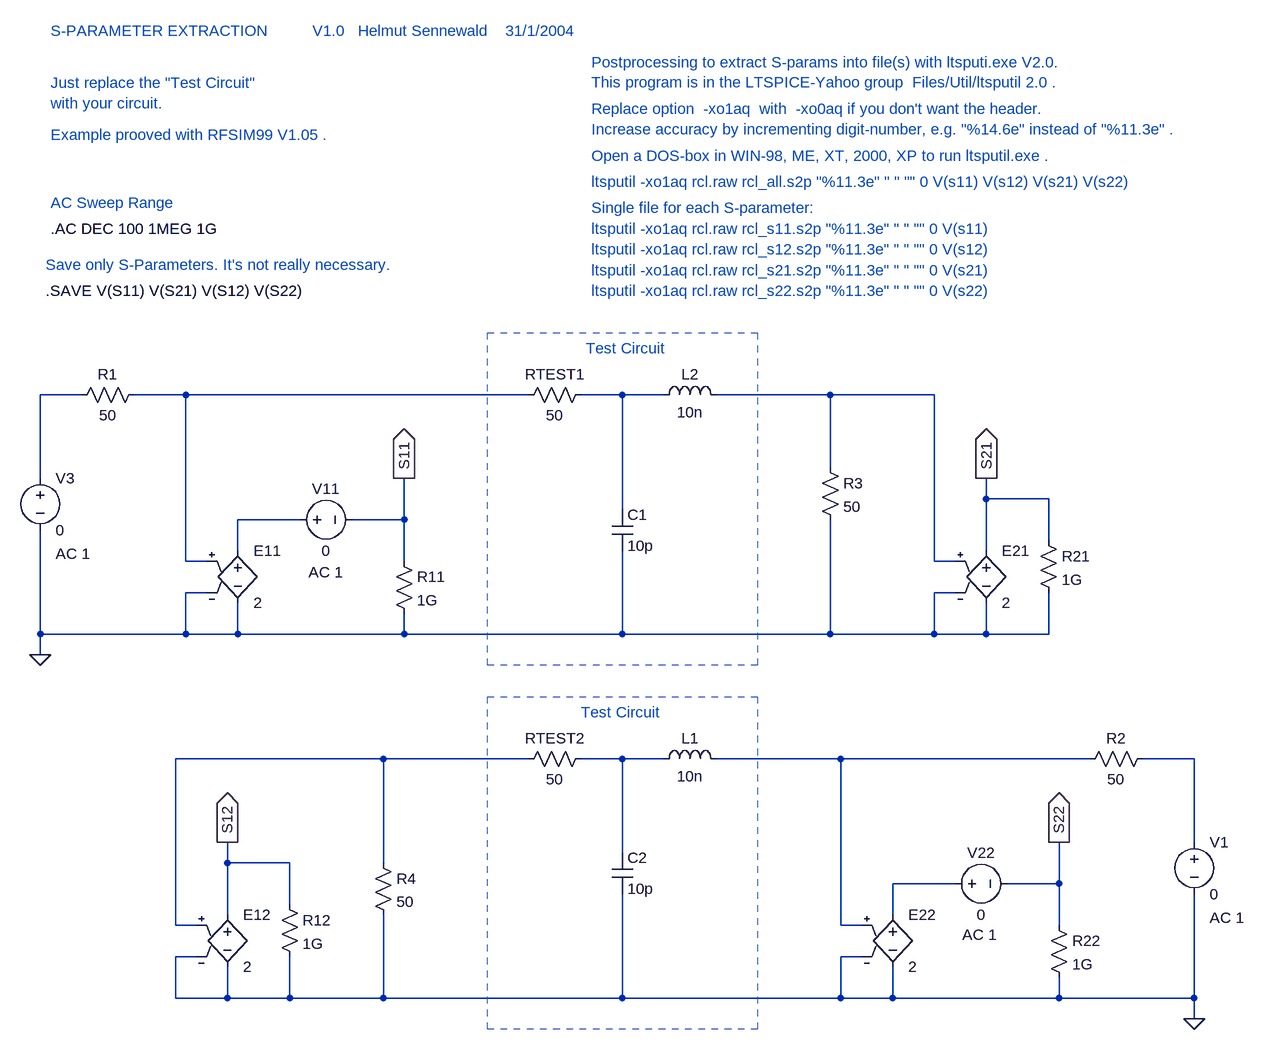
[diagram p0: schematic rcl.asc]
rcl.asc, the LTspice schematic file:
Version 4
SHEET 1 2416 916
WIRE 1728 16 1728 -112
WIRE 1728 96 1728 256
WIRE 1184 -112 992 -112
WIRE 1216 144 1184 144
WIRE 1184 144 1184 -112
WIRE 1216 192 1184 192
WIRE 1184 192 1184 256
WIRE 1184 256 848 256
WIRE 1264 208 1264 256
WIRE 1264 256 1184 256
WIRE 1264 128 1264 80
WIRE 1264 80 1360 80
WIRE 1440 80 1520 80
WIRE 1520 80 1520 144
WIRE 1520 224 1520 256
WIRE 1264 256 1520 256
WIRE 192 192 160 192
WIRE 160 192 160 256
WIRE 192 144 160 144
WIRE 160 144 160 -112
WIRE 240 208 240 256
WIRE 240 256 160 256
WIRE 240 128 240 48
WIRE 240 48 336 48
WIRE 336 112 336 48
WIRE 336 192 336 256
WIRE 336 256 240 256
WIRE 240 48 240 16
WIRE 1520 80 1520 16
WIRE 1728 256 1728 288
WIRE -48 -544 -48 -672
WIRE -48 -464 -48 -304
WIRE 1328 -672 1168 -672
WIRE 208 -416 176 -416
WIRE 176 -416 176 -672
WIRE 176 -672 96 -672
WIRE 208 -368 176 -368
WIRE 176 -368 176 -304
WIRE 176 -304 -48 -304
WIRE 256 -352 256 -304
WIRE 256 -304 176 -304
WIRE 16 -672 -48 -672
WIRE 256 -432 256 -480
WIRE 256 -480 352 -480
WIRE 432 -480 512 -480
WIRE 512 -480 512 -416
WIRE 512 -336 512 -304
WIRE 256 -304 512 -304
WIRE 1360 -368 1328 -368
WIRE 1328 -368 1328 -304
WIRE 1360 -416 1328 -416
WIRE 1328 -416 1328 -672
WIRE 1408 -352 1408 -304
WIRE 1408 -304 1328 -304
WIRE 1408 -432 1408 -512
WIRE 1408 -512 1504 -512
WIRE 1504 -448 1504 -512
WIRE 1504 -368 1504 -304
WIRE 1504 -304 1408 -304
WIRE 1408 -512 1408 -544
WIRE 512 -480 512 -544
WIRE 512 -304 848 -304
WIRE -48 -304 -48 -272
WIRE 1168 -560 1168 -672
WIRE 1168 -480 1168 -304
WIRE 704 -672 176 -672
WIRE 848 -496 848 -672
WIRE 848 -672 784 -672
WIRE 848 -432 848 -304
WIRE 848 -304 1168 -304
WIRE 1168 -672 992 -672
WIRE 1168 -304 1328 -304
WIRE 784 -112 848 -112
WIRE 848 32 848 -112
WIRE 848 96 848 256
WIRE 480 48 480 -112
WIRE 480 128 480 256
WIRE 848 256 480 256
WIRE 912 -112 848 -112
WIRE 912 -672 848 -672
WIRE 1184 -112 1568 -112
WIRE 704 -112 480 -112
WIRE 480 256 336 256
WIRE 480 -112 160 -112
WIRE 1520 256 1728 256
WIRE 1648 -112 1728 -112
FLAG 240 16 S12
IOPIN 240 16 Out
FLAG 1520 16 S22
IOPIN 1520 16 Out
FLAG 1728 288 0
FLAG 1408 -544 S21
IOPIN 1408 -544 Out
FLAG 512 -544 S11
IOPIN 512 -544 Out
FLAG -48 -272 0
SYMBOL F:\\PROGRAMME\\LTC\\SWCADIII\\lib\\sym\\voltage 1728 0 R0
WINDOW 123 24 132 Left 0
WINDOW 39 24 160 Left 0
SYMATTR Value2 AC 1
SYMATTR InstName V1
SYMATTR Value 0
SYMBOL F:\\PROGRAMME\\LTC\\SWCADIII\\lib\\sym\\res 1552 -96 R270
WINDOW 0 32 56 VTop 0
WINDOW 3 0 56 VBottom 0
SYMATTR InstName R2
SYMATTR Value 50
SYMBOL F:\\PROGRAMME\\LTC\\SWCADIII\\lib\\sym\\e 1264 112 R0
SYMATTR InstName E22
SYMATTR Value 2
SYMBOL F:\\PROGRAMME\\LTC\\SWCADIII\\lib\\sym\\res 1504 128 R0
SYMATTR InstName R22
SYMATTR Value 1G
SYMBOL F:\\PROGRAMME\\LTC\\SWCADIII\\lib\\sym\\voltage 1344 80 R270
WINDOW 0 32 56 VTop 0
WINDOW 3 -32 56 VBottom 0
WINDOW 123 -63 54 VBottom 0
WINDOW 39 -60 56 VBottom 0
SYMATTR InstName V22
SYMATTR Value 0
SYMATTR Value2 AC 1
SYMBOL F:\\PROGRAMME\\LTC\\SWCADIII\\lib\\sym\\e 240 112 R0
SYMATTR InstName E12
SYMATTR Value 2
SYMBOL F:\\PROGRAMME\\LTC\\SWCADIII\\lib\\sym\\res 320 96 R0
SYMATTR InstName R12
SYMATTR Value 1G
SYMBOL F:\\PROGRAMME\\LTC\\SWCADIII\\lib\\sym\\voltage -48 -560 R0
WINDOW 123 24 132 Left 0
WINDOW 39 24 160 Left 0
SYMATTR Value2 AC 1
SYMATTR InstName V3
SYMATTR Value 0
SYMBOL F:\\PROGRAMME\\LTC\\SWCADIII\\lib\\sym\\res 0 -656 R270
WINDOW 0 32 56 VTop 0
WINDOW 3 0 56 VBottom 0
SYMATTR InstName R1
SYMATTR Value 50
SYMBOL F:\\PROGRAMME\\LTC\\SWCADIII\\lib\\sym\\e 256 -448 R0
SYMATTR InstName E11
SYMATTR Value 2
SYMBOL F:\\PROGRAMME\\LTC\\SWCADIII\\lib\\sym\\res 496 -432 R0
SYMATTR InstName R11
SYMATTR Value 1G
SYMBOL F:\\PROGRAMME\\LTC\\SWCADIII\\lib\\sym\\voltage 336 -480 R270
WINDOW 0 32 56 VTop 0
WINDOW 3 -32 56 VBottom 0
WINDOW 123 -65 56 VBottom 0
WINDOW 39 -60 56 VBottom 0
SYMATTR InstName V11
SYMATTR Value 0
SYMATTR Value2 AC 1
SYMBOL F:\\PROGRAMME\\LTC\\SWCADIII\\lib\\sym\\e 1408 -448 R0
SYMATTR InstName E21
SYMATTR Value 2
SYMBOL F:\\PROGRAMME\\LTC\\SWCADIII\\lib\\sym\\res 1488 -464 R0
SYMATTR InstName R21
SYMATTR Value 1G
SYMBOL F:\\PROGRAMME\\LTC\\SWCADIII\\lib\\sym\\res 688 -656 R270
WINDOW 0 32 56 VTop 0
WINDOW 3 0 56 VBottom 0
SYMATTR InstName RTEST1
SYMATTR Value 50
SYMBOL F:\\PROGRAMME\\LTC\\SWCADIII\\lib\\sym\\res 688 -96 R270
WINDOW 0 32 56 VTop 0
WINDOW 3 0 56 VBottom 0
SYMATTR InstName RTEST2
SYMATTR Value 50
SYMBOL F:\\PROGRAMME\\LTC\\SWCADIII\\lib\\sym\\cap 832 -496 R0
SYMATTR InstName C1
SYMATTR Value 10p
SYMBOL F:\\PROGRAMME\\LTC\\SWCADIII\\lib\\sym\\res 1152 -576 R0
SYMATTR InstName R3
SYMATTR Value 50
SYMBOL cap 832 32 R0
SYMATTR InstName C2
SYMATTR Value 10p
SYMBOL res 464 32 R0
SYMATTR InstName R4
SYMATTR Value 50
SYMBOL ind 896 -96 R270
WINDOW 0 32 56 VTop 0
WINDOW 3 5 56 VBottom 0
SYMATTR InstName L1
SYMATTR Value 10n
SYMBOL ind 896 -656 R270
WINDOW 0 32 56 VTop 0
WINDOW 3 5 56 VBottom 0
SYMATTR InstName L2
SYMATTR Value 10n
TEXT -32 -928 Left 0 !.AC DEC 100 1MEG 1G
TEXT -40 -832 Left 0 !.SAVE V(S11) V(S21) V(S12) V(S22)
TEXT 792 -744 Left 0 ;Test Circuit
TEXT 784 -184 Left 0 ;Test Circuit
TEXT -32 -1232 Left 0 ;S-PARAMETER EXTRACTION          V1.0   Helmut Sennewald    31/1/2004
TEXT -40 -872 Left 0 ;Save only S-Parameters. It's not really necessary.
TEXT -32 -968 Left 0 ;AC Sweep Range
TEXT 800 -1000 Left 0 ;ltsputil -xo1aq rcl.raw rcl_all.s2p "%11.3e" " " "" 0 V(s11) V(s12) V(s21) V(s22)
TEXT 800 -1184 Left 0 ;Postprocessing to extract S-params into file(s) with ltsputi.exe V2.0. \nThis program is in the LTSPICE-Yahoo group  Files/Util/ltsputil 2.0 .
TEXT 800 -928 Left 0 ;ltsputil -xo1aq rcl.raw rcl_s11.s2p "%11.3e" " " "" 0 V(s11)
TEXT 800 -896 Left 0 ;ltsputil -xo1aq rcl.raw rcl_s12.s2p "%11.3e" " " "" 0 V(s12)
TEXT 800 -864 Left 0 ;ltsputil -xo1aq rcl.raw rcl_s21.s2p "%11.3e" " " "" 0 V(s21)
TEXT 800 -832 Left 0 ;ltsputil -xo1aq rcl.raw rcl_s22.s2p "%11.3e" " " "" 0 V(s22)
TEXT 800 -1112 Left 0 ;Replace option  -xo1aq  with  -xo0aq if you don't want the header.\nIncrease accuracy by incrementing digit-number, e.g. "%14.6e" instead of "%11.3e" .
TEXT -32 -1152 Left 0 ;Just replace the "Test Circuit" \nwith your circuit.
TEXT -32 -1072 Left 0 ;Example prooved with RFSIM99 V1.05 .
TEXT 800 -960 Left 0 ;Single file for each S-parameter:
TEXT 800 -1040 Left 0 ;Open a DOS-box in WIN-98, ME, XT, 2000, XP to run ltsputil.exe .
RECTANGLE Normal 1056 -256 640 -768 2
RECTANGLE Normal 1056 304 640 -208 2

The netlist it stands for:
* rcl.asc
V1 N001 0 0 AC 1
R2 N002 N001 50
E22 N003 0 N002 0 2
R22 S22 0 1G
V22 N003 S22 0 AC 1
E12 S12 0 N004 0 2
R12 S12 0 1G
V3 N005 0 0 AC 1
R1 N005 N007 50
E11 N008 0 N007 0 2
R11 S11 0 1G
V11 N008 S11 0 AC 1
E21 S21 0 N006 0 2
R21 S21 0 1G
RTEST1 N007 N009 50
RTEST2 N004 N010 50
C1 N009 0 10p
R3 N006 0 50
C2 N010 0 10p
R4 N004 0 50
L1 N010 N002 10n
L2 N009 N006 10n
.AC DEC 100 1MEG 1G
.SAVE V(S11) V(S21) V(S12) V(S22)
* Test Circuit
* Test Circuit
* S-PARAMETER EXTRACTION          V1.0   Helmut Sennewald    31/1/2004
* Save only S-Parameters. It's not really necessary.
* AC Sweep Range
* ltsputil -xo1aq rcl.raw rcl_all.s2p "%11.3e" " " "" 0 V(s11) V(s12) V(s21) V(s22)
* Postprocessing to extract S-params into file(s) with ltsputi.exe V2.0.
* This program is in the LTSPICE-Yahoo group  Files/Util/ltsputil 2.0 .
* ltsputil -xo1aq rcl.raw rcl_s11.s2p "%11.3e" " " "" 0 V(s11)
* ltsputil -xo1aq rcl.raw rcl_s12.s2p "%11.3e" " " "" 0 V(s12)
* ltsputil -xo1aq rcl.raw rcl_s21.s2p "%11.3e" " " "" 0 V(s21)
* ltsputil -xo1aq rcl.raw rcl_s22.s2p "%11.3e" " " "" 0 V(s22)
* Replace option  -xo1aq  with  -xo0aq if you don't want the header.
* Increase accuracy by incrementing digit-number, e.g. "%14.6e" instead of "%11.3e" .
* Just replace the "Test Circuit"
* with your circuit.
* Example prooved with RFSIM99 V1.05 .
* Single file for each S-parameter:
* Open a DOS-box in WIN-98, ME, XT, 2000, XP to run ltsputil.exe .
.backanno
.end